# EAGLE design TempGuard-v2-revB (EAGLE 9.6.1)
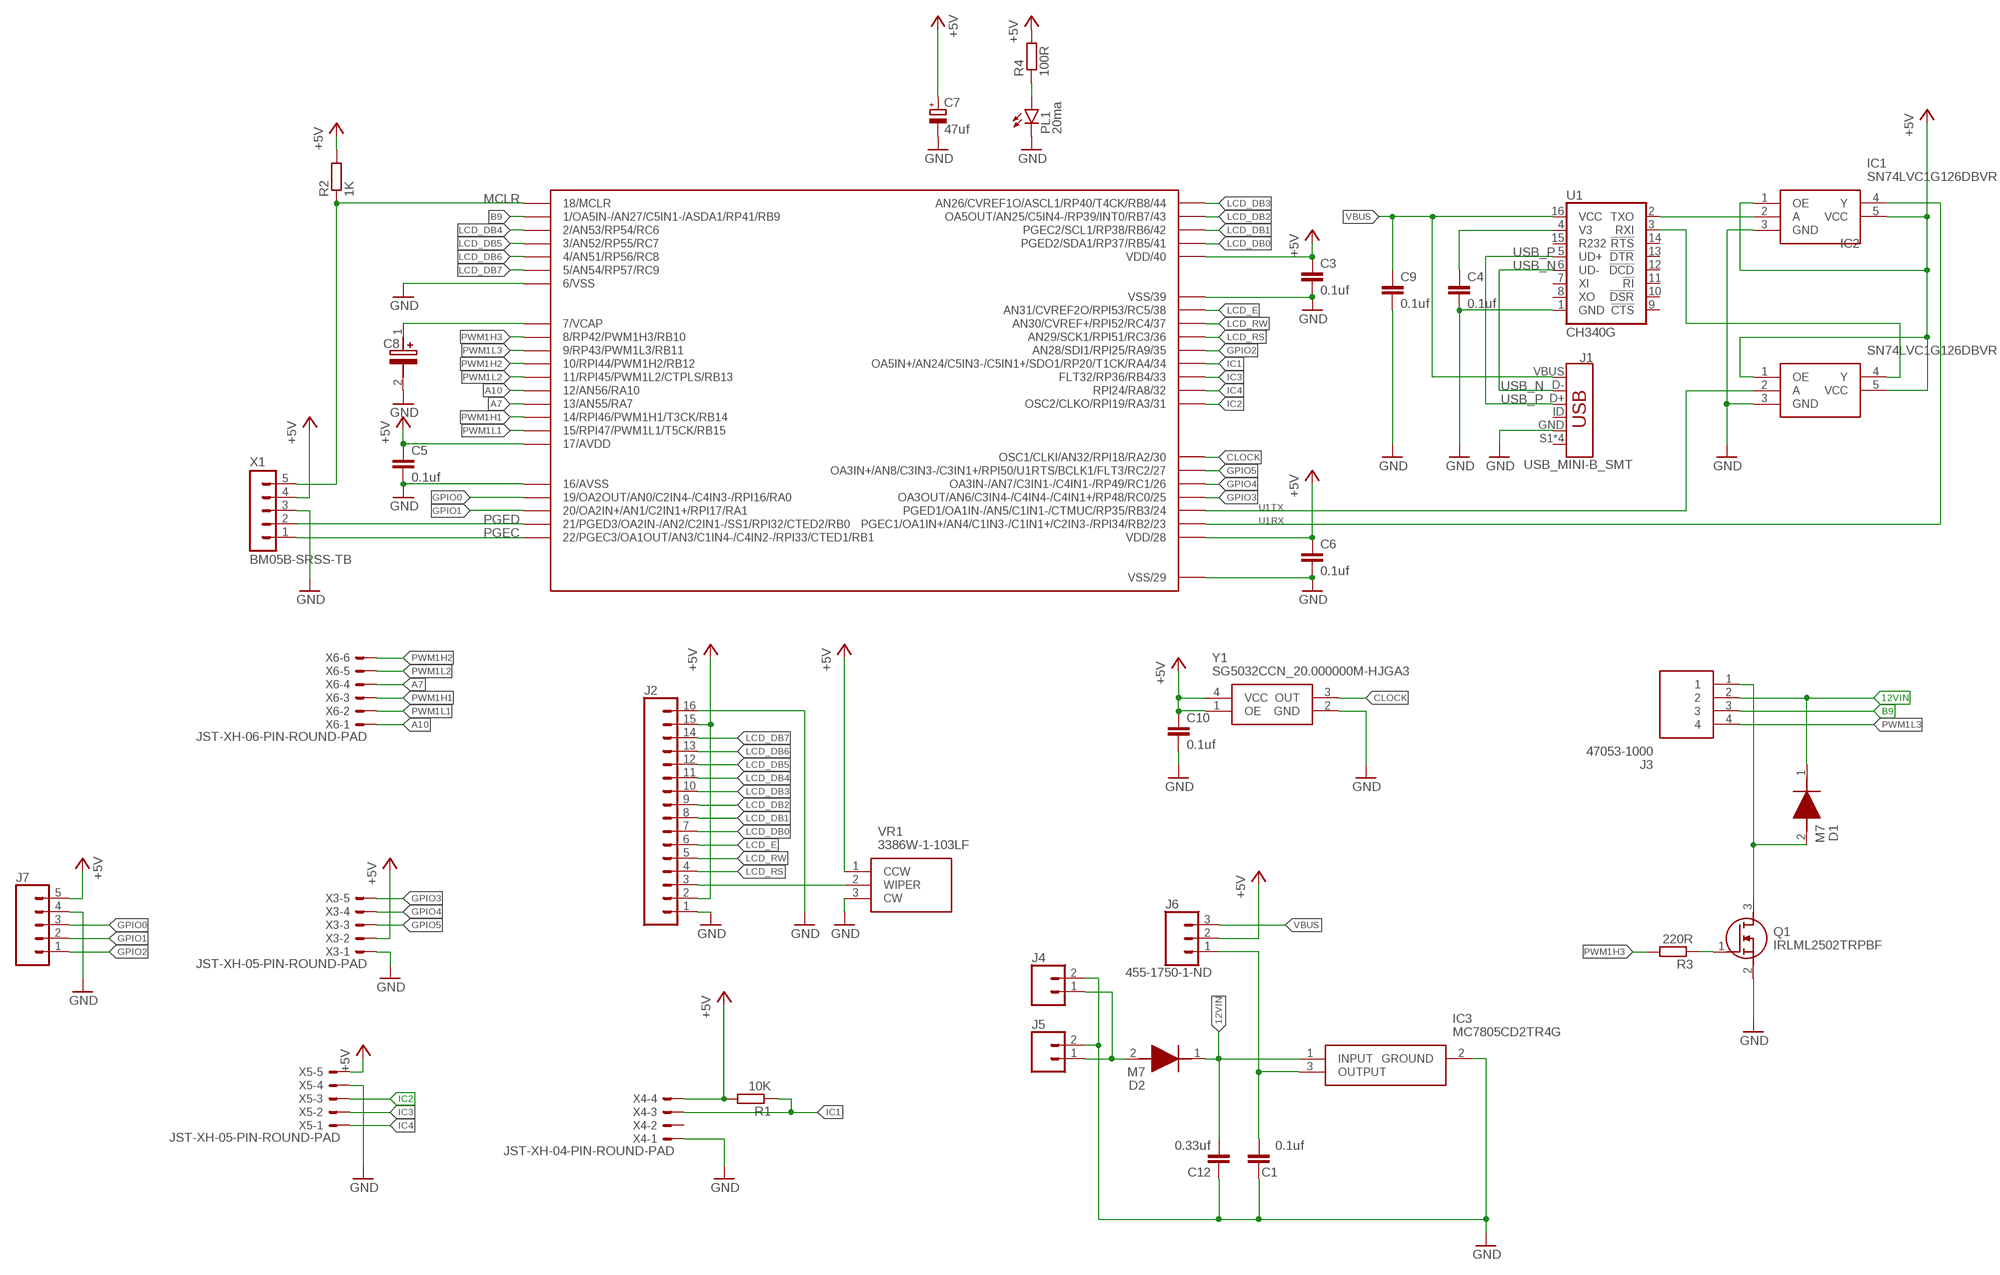
[diagram p0: schematic, sheet 1]

## Parts
C1  0.1uf  C-EUC0805  [C0805]
C3  0.1uf  C-EUC0805  [C0805]
C4  0.1uf  C-EUC0805  [C0805]
C5  0.1uf  C-EUC0805  [C0805]
C6  0.1uf  C-EUC0805  [C0805]
C7  47uf  CPOL-EUE2-5  [E2-5]
C8  T491C106K016ATAUTO  [T491C]
C9  0.1uf  C-EUC0805  [C0805]
C10  0.1uf  C-EUC0805  [C0805]
C12  0.33uf  C-EUC1206  [C1206]
D1  M7  [DIOM5327X240N]
D2  M7  [DIOM5327X240N]
IC1  SN74LVC1G126DBVR  [SOT95P280X145-5N]
IC2  SN74LVC1G126DBVR  [SOT95P280X145-5N]
IC3  MC7805CD2TR4G  [MC7805CD2TR4G]
J1  USB_MINI-B_SMT  [USB-MINIB]
J2  CONN_16LONGPADS  [1X16_LONGPADS]
J3  47053-1000  [470531000]
J4  CONN_025MM  [SCREWTERMINAL-5MM-2]
J5  CONN_025MM  [SCREWTERMINAL-5MM-2]
J6  455-1750-1-ND  CONN_03  [1X03]
J7  CONN_05  [1X05]
MCU1  DSPIC33EV64GM004-I/PT  [QFP80P1200X1200X120-44]
PL1  20ma  LEDSML0805  [SML0805]
Q1  IRLML2502TRPBF  [SOT95P237X112-3N]
R1  10K  R-EU_R0805  [R0805]
R2  1K  R-EU_R0805  [R0805]
R3  220R  R-EU_R0805  [R0805]
R4  100R  R-EU_R0805  [R0805]
U1  CH340G  CH340GSMD  [SO016]
VR1  3386W-1-103LF  [3386W]
X1  BM05B-SRSS-TB  [BM05B-SRSS-TB]
X3  JST-XH-05-PIN-ROUND-PAD  [JST-XH-05-PACKAGE-ROUND-PAD]
X4  JST-XH-04-PIN-ROUND-PAD  [JST-XH-04-PACKAGE-ROUND-PAD]
X5  JST-XH-05-PIN-ROUND-PAD  [JST-XH-05-PACKAGE-ROUND-PAD]
X6  JST-XH-06-PIN-ROUND-PAD  [JST-XH-06-PACKAGE-ROUND-PAD]
Y1  SG5032CCN_20.000000M-HJGA3  [SG5032CCN20000000MHJGA3]

## Nets
12VIN [logic]: C12.2 D1.1(K) D2.1(K) IC3.1(INPUT) J3.2
+5V [power]: C3.1 C5.1 C6.1 C7.+ C10.1 IC1.1(OE) IC1.5(VCC) IC2.1(OE) IC2.5(VCC) J2.2 J2.15 J6.2 J7.5 MCU1.17(17/AVDD) MCU1.28(VDD/28) MCU1.40(VDD/40) R1.2 R2.2 R4.2 VR1.1(CCW) X1.4 X3.2 X4.4 X5.5 Y1.1(OE) Y1.4(VCC)
A7 [logic]: MCU1.13(13/AN55/RA7) X6.4
A10 [logic]: MCU1.12(12/AN56/RA10) X6.1
B9 [logic]: J3.3 MCU1.1(1/OA5IN-/AN27/C5IN1-/ASDA1/RP41/RB9)
CLOCK [logic]: MCU1.30(OSC1/CLKI/AN32/RPI18/RA2/30) Y1.3(OUT)
GND [power]: C1.1 C3.2 C4.2 C5.2 C6.2 C7.- C8.2(-) C9.2 C10.2 C12.1 IC1.3(GND) IC2.3(GND) IC3.2(GROUND) J1.GND J2.1 J2.16 J4.2 J5.2 J7.4 MCU1.6(6/VSS) MCU1.16(16/AVSS) MCU1.29(VSS/29) MCU1.39(VSS/39) PL1.C Q1.2(S) U1.1(GND) VR1.3(CW) X1.3 X3.1 X4.1 X5.4 Y1.2(GND)
GPIO0 [logic]: J7.3 MCU1.19(19/OA2OUT/AN0/C2IN4-/C4IN3-/RPI16/RA0)
GPIO1 [logic]: J7.2 MCU1.20(20/OA2IN+/AN1/C2IN1+/RPI17/RA1)
GPIO2 [logic]: J7.1 MCU1.35(AN28/SDI1/RPI25/RA9/35)
GPIO3 [logic]: MCU1.25(OA3OUT/AN6/C3IN4-/C4IN4-/C4IN1+/RP48/RC0/25) X3.5
GPIO4 [logic]: MCU1.26(OA3IN-/AN7/C3IN1-/C4IN1-/RP49/RC1/26) X3.4
GPIO5 [logic]: MCU1.27(OA3IN+/AN8/C3IN3-/C3IN1+/RPI50/U1RTS/BCLK1/FLT3/RC2/27) X3.3
IC1 [logic]: MCU1.34(OA5IN+/AN24/C5IN3-/C5IN1+/SDO1/RP20/T1CK/RA4/34) R1.1 X4.3
IC2 [logic]: MCU1.31(OSC2/CLKO/RPI19/RA3/31) X5.3
IC3 [logic]: MCU1.33(FLT32/RP36/RB4/33) X5.2
IC4 [logic]: MCU1.32(RPI24/RA8/32) X5.1
LCD_DB0 [logic]: J2.7 MCU1.41(PGED2/SDA1/RP37/RB5/41)
LCD_DB1 [logic]: J2.8 MCU1.42(PGEC2/SCL1/RP38/RB6/42)
LCD_DB2 [logic]: J2.9 MCU1.43(OA5OUT/AN25/C5IN4-/RP39/INT0/RB7/43)
LCD_DB3 [logic]: J2.10 MCU1.44(AN26/CVREF1O/ASCL1/RP40/T4CK/RB8/44)
LCD_DB4 [logic]: J2.11 MCU1.2(2/AN53/RP54/RC6)
LCD_DB5 [logic]: J2.12 MCU1.3(3/AN52/RP55/RC7)
LCD_DB6 [logic]: J2.13 MCU1.4(4/AN51/RP56/RC8)
LCD_DB7 [logic]: J2.14 MCU1.5(5/AN54/RP57/RC9)
LCD_E [logic]: J2.6 MCU1.38(AN31/CVREF2O/RPI53/RC5/38)
LCD_RS [logic]: J2.4 MCU1.36(AN29/SCK1/RPI51/RC3/36)
LCD_RW [logic]: J2.5 MCU1.37(AN30/CVREF+/RPI52/RC4/37)
MCLR [logic]: MCU1.18(18/MCLR) R2.1 X1.5
N$1 [logic]: C4.1 U1.4(V3)
N$3 [power]: D1.2(A) J3.1 Q1.3(D)
N$4 [logic]: IC1.2(A) U1.2(TXO)
N$5 [logic]: J2.3 VR1.2(WIPER)
N$6 [logic]: PL1.A R4.1
N$7: Q1.1(G) R3.1
N$8 [logic]: D2.2(A) J4.1 J5.1
N$9 [power]: C1.2 IC3.3(OUTPUT) J6.1
N$14 [logic]: IC2.4(Y) U1.3(RXI)
PGEC [logic]: MCU1.22(22/PGEC3/OA1OUT/AN3/C1IN4-/C4IN2-/RPI33/CTED1/RB1) X1.1
PGED [logic]: MCU1.21(21/PGED3/OA2IN-/AN2/C2IN1-/SS1/RPI32/CTED2/RB0) X1.2
PWM1H1 [logic]: MCU1.14(14/RPI46/PWM1H1/T3CK/RB14) X6.3
PWM1H2 [logic]: MCU1.10(10/RPI44/PWM1H2/RB12) X6.6
PWM1H3 [logic]: MCU1.8(8/RP42/PWM1H3/RB10) R3.2
PWM1L1 [logic]: MCU1.15(15/RPI47/PWM1L1/T5CK/RB15) X6.2
PWM1L2 [logic]: MCU1.11(11/RPI45/PWM1L2/CTPLS/RB13) X6.5
PWM1L3 [logic]: J3.4 MCU1.9(9/RP43/PWM1L3/RB11)
U1RX [logic]: IC1.4(Y) MCU1.23(PGEC1/OA1IN+/AN4/C1IN3-/C1IN1+/C2IN3-/RPI34/RB2/23)
U1TX [logic]: IC2.2(A) MCU1.24(PGED1/OA1IN-/AN5/C1IN1-/CTMUC/RP35/RB3/24)
USB_N [logic]: J1.D- U1.6(UD-)
USB_P [logic]: J1.D+ U1.5(UD+)
VBUS [logic]: C9.1 J1.VBUS J6.3 U1.16(VCC)
VCAP [logic]: C8.1(+) MCU1.7(7/VCAP)
Unconnected: J1.ID J1.S1(SHIELD) J1.S2(SHIELD) J1.S3(SHIELD) J1.S4(SHIELD) U1.7(XI) U1.8(XO) U1.9(!CTS) U1.10(!DSR) U1.11(!RI) U1.12(!DCD) U1.13(!DTR) U1.14(!RTS) U1.15(R232) X4.2

## Library data of the parts
C1 C3-C6 C9 C10 C12 = rcl:C-EU: CAPACITOR, European symbol; SPICEPREFIX: C
C7 = rcl:CPOL-EU: POLARIZED CAPACITOR, European symbol; SPICEPREFIX: C
C8 = T491C106K016ATAUTO:T491C106K016ATAUTO: T491 Auto, Tantalum, MnO2 Tantalum, Commercial Grade, 10 uF, 10%, 16 VDC, 125C, -55C, 85C, SMD, MnO2, Molded, Auto, AEC-Q200, 6 % , 1.8 Ohms, 1600 nA, 224.48 mg, 6032, 2.5mm, Height Max = 2.8mm, 500 Source: Datasheet <https://content.kemet.com/datasheets/KEM_T2050_T491_AUTO.pdf>; DESCRIPTION: T491 Auto, Tantalum, MnO2 Tantalum, Commercial Grade, 10 uF, 10%, 16 VDC, 125C, -55C, 85C, SMD, MnO2, Molded, Auto, AEC-Q200, 6 % , 1.8 Ohms, 1600 nA, 224.48 mg, 6032, 2.5mm, Height Max = 2.8mm, 500; HEIGHT: 2.8mm; MANUFACTURER_NAME: KEMET; MANUFACTURER_PART_NUMBER: T491C106K016ATAUTO; MOUSER_PART_NUMBER: 80-T491C106K16ATAUTO; MOUSER_PRICE-STOCK: https://www.mouser.co.uk/ProductDetail/KEMET/T491C106K016ATAUTO?qs=xy9o06WtvdCgLOa6Blm85A%3D%3D; VALUEX: 10uF
D1 D2 = M7:M7: Standard recovery rectifier diode Source: Datasheet <https://www.mouser.in/datasheet/2/849/m1-2577421.pdf>; DESCRIPTION: Standard recovery rectifier diode; HEIGHT: 2.4mm; MANUFACTURER_NAME: Diotec; MANUFACTURER_PART_NUMBER: M7; MOUSER_PART_NUMBER: 637-M7; MOUSER_PRICE-STOCK: https://www.mouser.co.uk/ProductDetail/Diotec-Semiconductor/M7?qs=OlC7AqGiEDln9itgkDD%2F2A%3D%3D
IC1 IC2 = SN74LVC1G126DBVR:SN74LVC1G126DBVR: Texas Instruments SN74LVC1G126DBVR, Buffer 3-State, Non-Inverting, 1.65 5.5 V, 5-Pin SOT-23 Source: Datasheet <http://www.ti.com/lit/ds/symlink/sn74lvc1g126.pdf>; DESCRIPTION: Texas Instruments SN74LVC1G126DBVR, Buffer 3-State, Non-Inverting, 1.65 5.5 V, 5-Pin SOT-23; HEIGHT: 1.45mm; MANUFACTURER_NAME: Texas Instruments; MANUFACTURER_PART_NUMBER: SN74LVC1G126DBVR; MOUSER_PART_NUMBER: 595-SN74LVC1G126DBVR; MOUSER_PRICE-STOCK: https://www.mouser.co.uk/ProductDetail/Texas-Instruments/SN74LVC1G126DBVR?qs=pajgIaoyDUi3T2WgNNfd3w%3D%3D
IC3 = MC7805CD2TR4G:MC7805CD2TR4G: Linear Voltage Regulators 5V 1A Positive Source: Datasheet <https://datasheet.lcsc.com/szlcsc/ON-Semicon-ON-MC7805CD2TR4G_C38743.pdf>; DESCRIPTION: Linear Voltage Regulators 5V 1A Positive; HEIGHT: 4.572mm; MANUFACTURER_NAME: onsemi; MANUFACTURER_PART_NUMBER: MC7805CD2TR4G; MOUSER_PART_NUMBER: 863-MC7805CD2TR4G; MOUSER_PRICE-STOCK: https://www.mouser.co.uk/ProductDetail/onsemi/MC7805CD2TR4G?qs=%252B9%2Fcbd0IE0TA2t8QN7DaSw%3D%3D
J1 = SparkFun-Connectors:USB_MINI-B: USB type Mini-B Connector Breaks out 5th pin, and includes shield pins if needed. SparkFun Products: SparkFun FTDI Basic Breakout <https://www.sparkfun.com/products/9716> SparkFun XBee Explorer USB <https://www.sparkfun.com/products/11812> SparkFun Redboard <https://www.sparkfun.com/products/12757>; PROD_ID: CONN-08193; SF_ID: PRT-00587
J2 = SparkFun-Connectors:CONN_16: Multi connection point. Often used as Generic Header-pin footprint for 0.1 inch spaced/style header connections On any of the 0.1 inch spaced packages, you can populate with these: Break Away Headers - Straight <https://www.sparkfun.com/products/116> (PRT-00116) Break Away Male Headers - Right Angle <https://www.sparkfun.com/products/553> (PRT-00553) Female Headers <https://www.sparkfun.com/products/115> (PRT-00115) Break Away Headers - Machine Pin <https://www.sparkfun.com/products/117> (PRT-00117) Break Away Female Headers - Swiss Machine Pin <https://www.sparkfun.com/products/743> (PRT-00743) For SCREWTERMINALS and SPRING TERMINALS visit here: Screw Terimnals on SparkFun.com <https://www.sparkfun.com/search/results?term=Screw+Terminals> (5mm/3.5mm/2.54mm spacing) This device is also useful as a general connection point to wire up your design to another part of your project. Our various solder wires solder well into these plated through hole pads. Hook-Up Wire - Assortment (Stranded, 22 AWG) <https://www.sparkfun.com/products/11375> (PRT-11375) Hook-Up Wire - Assortment (Solid Core, 22 AWG) <https://www.sparkfun.com/products/11367> (PRT-11367) View the entire wire category on our website here <https://www.sparkfun.com/categories/141> Special notes: Molex polarized connector foot print use with SKU : PRT-08231 with associated crimp pins and housings. 1MM SMD Version SKU: PRT-10208 NOTES ON THE VARIANTS LOCK and LOCK_LONGPADS... This footprint was designed to help hold the alignment of a through-hole component (i.e. 6-pin header) while soldering it into place. You may notice that each hole has been shifted either up or down by 0.005 of an inch from it's more standard position (which is a perfectly straight line). This slight alteration caused the pins (the squares in the middle) to touch the edges of the holes. Because they are alternating, it causes a "brace" to hold the component in place. 0.005 has proven to be the perfect amount of "off-center" position when using our standard breakaway headers. Although looks a little odd when you look at the bare footprint, once you have a header in there, the alteration is very hard to notice. Also,if you push a header all the way into place, it is covered up entirely on the bottom side.
J3 = 47053-1000:47053-1000: MOLEX - 47053-1000 - HEADER, 4POS, 1ROW, 2.54MM Source: Datasheet <http://www.molex.com/pdm_docs/sd/470531000_sd.pdf>; DESCRIPTION: MOLEX - 47053-1000 - HEADER, 4POS, 1ROW, 2.54MM; HEIGHT: 8mm; MANUFACTURER_NAME: Molex; MANUFACTURER_PART_NUMBER: 47053-1000; MOUSER_PART_NUMBER: 538-47053-1000; MOUSER_PRICE-STOCK: https://www.mouser.co.uk/ProductDetail/Molex/47053-1000?qs=ph4zPCVRuvqoDX7hrEhxNA%3D%3D
J4 J5 = SparkFun-Connectors:CONN_02: Multi connection point. Often used as Generic Header-pin footprint for 0.1 inch spaced/style header connections On any of the 0.1 inch spaced packages, you can populate with these: Break Away Headers - Straight <https://www.sparkfun.com/products/116> (PRT-00116) Break Away Male Headers - Right Angle <https://www.sparkfun.com/products/553> (PRT-00553) Female Headers <https://www.sparkfun.com/products/115> (PRT-00115) Break Away Headers - Machine Pin <https://www.sparkfun.com/products/117> (PRT-00117) Break Away Female Headers - Swiss Machine Pin <https://www.sparkfun.com/products/743> (PRT-00743) For SCREWTERMINALS and SPRING TERMINALS visit here: Screw Terimnals on SparkFun.com <https://www.sparkfun.com/search/results?term=Screw+Terminals> (5mm/3.5mm/2.54mm spacing) This device is also useful as a general connection point to wire up your design to another part of your project. Our various solder wires solder well into these plated through hole pads. Hook-Up Wire - Assortment (Stranded, 22 AWG) <https://www.sparkfun.com/products/11375> (PRT-11375) Hook-Up Wire - Assortment (Solid Core, 22 AWG) <https://www.sparkfun.com/products/11367> (PRT-11367) View the entire wire category on our website here <https://www.sparkfun.com/categories/141> Special notes: Molex polarized connector foot print use with: PRT-08233 with associated crimp pins and housings. 2.54_SCREWTERM for use with PRT-10571. 3.5mm Screw Terminal footprints for PRT-08084 5mm Screw Terminal footprints for use with PRT-08432; SF_SKU: PRT-08432
J6 = SparkFun-Connectors:CONN_03: Multi connection point. Often used as Generic Header-pin footprint for 0.1 inch spaced/style header connections On any of the 0.1 inch spaced packages, you can populate with these: Break Away Headers - Straight <https://www.sparkfun.com/products/116> (PRT-00116) Break Away Male Headers - Right Angle <https://www.sparkfun.com/products/553> (PRT-00553) Female Headers <https://www.sparkfun.com/products/115> (PRT-00115) Break Away Headers - Machine Pin <https://www.sparkfun.com/products/117> (PRT-00117) Break Away Female Headers - Swiss Machine Pin <https://www.sparkfun.com/products/743> (PRT-00743) Stackable Header - 3 Pin (Female, 0.1") <https://www.sparkfun.com/products/13875> (PRT-13875) For SCREWTERMINALS and SPRING TERMINALS visit here: Screw Terimnals on SparkFun.com <https://www.sparkfun.com/search/results?term=Screw+Terminals> (5mm/3.5mm/2.54mm spacing) This device is also useful as a general connection point to wire up your design to another part of your project. Our various solder wires solder well into these plated through hole pads. Hook-Up Wire - Assortment (Stranded, 22 AWG) <https://www.sparkfun.com/products/11375> (PRT-11375) Hook-Up Wire - Assortment (Solid Core, 22 AWG) <https://www.sparkfun.com/products/11367> (PRT-11367) View the entire wire category on our website here <https://www.sparkfun.com/categories/141> Special notes: Molex polarized connector foot print use with SKU : PRT-08232 with associated crimp pins and housings.; PROD_ID: XXX-00000
J7 = SparkFun-Connectors:CONN_05: Multi connection point. Often used as Generic Header-pin footprint for 0.1 inch spaced/style header connections On any of the 0.1 inch spaced packages, you can populate with these: Break Away Headers - Straight <https://www.sparkfun.com/products/116> (PRT-00116) Break Away Male Headers - Right Angle <https://www.sparkfun.com/products/553> (PRT-00553) Female Headers <https://www.sparkfun.com/products/115> (PRT-00115) Break Away Headers - Machine Pin <https://www.sparkfun.com/products/117> (PRT-00117) Break Away Female Headers - Swiss Machine Pin <https://www.sparkfun.com/products/743> (PRT-00743) For SCREWTERMINALS and SPRING TERMINALS visit here: Screw Terimnals on SparkFun.com <https://www.sparkfun.com/search/results?term=Screw+Terminals> (5mm/3.5mm/2.54mm spacing) This device is also useful as a general connection point to wire up your design to another part of your project. Our various solder wires solder well into these plated through hole pads. Hook-Up Wire - Assortment (Stranded, 22 AWG) <https://www.sparkfun.com/products/11375> (PRT-11375) Hook-Up Wire - Assortment (Solid Core, 22 AWG) <https://www.sparkfun.com/products/11367> (PRT-11367) View the entire wire category on our website here <https://www.sparkfun.com/categories/141> Special notes: Molex polarized connector foot print use with SKU : PRT-08231 with associated crimp pins and housings. 1MM SMD Version SKU: PRT-10208
MCU1 = Angelo-Microcontrollers:DSPIC33EV64GM004-I/PT: dsPIC33EV64GM004-I/PT
PL1 = led:LED: LED OSRAM: - CHIPLED LG R971, LG N971, LY N971, LG Q971, LY Q971, LO R971, LY R971 LH N974, LH R974 LS Q976, LO Q976, LY Q976 LO Q996 - Hyper CHIPLED LW Q18S LB Q993, LB Q99A, LB R99A - SideLED LS A670, LO A670, LY A670, LG A670, LP A670 LB A673, LV A673, LT A673, LW A673 LH A674 LY A675 LS A676, LA A676, LO A676, LY A676, LW A676 LS A679, LY A679, LG A679 - Hyper Micro SIDELED® LS Y876, LA Y876, LO Y876, LY Y876 LT Y87S - SmartLED LW L88C, LW L88S LB L89C, LB L89S, LG L890 LS L89K, LO L89K, LY L89K LS L896, LA L896, LO L896, LY L896 - TOPLED LS T670, LO T670, LY T670, LG T670, LP T670 LSG T670, LSP T670, LSY T670, LOP T670, LYG T670 LG T671, LOG T671, LSG T671 LB T673, LV T673, LT T673, LW T673 LH T674 LS T676, LA T676, LO T676, LY T676, LB T676, LH T676, LSB T676, LW T676 LB T67C, LV T67C, LT T67C, LS T67K, LO T67K, LY T67K, LW E67C LS E67B, LA E67B, LO E67B, LY E67B, LB E67C, LV E67C, LT E67C LW T67C LS T679, LY T679, LG T679 LS T770, LO T770, LY T770, LG T770, LP T770 LB T773, LV T773, LT T773, LW T773 LH T774 LS E675, LA E675, LY E675, LS T675 LS T776, LA T776, LO T776, LY T776, LB T776 LHGB T686 LT T68C, LB T68C - Hyper Mini TOPLED® LB M676 - Mini TOPLED Santana® LG M470 LS M47K, LO M47K, LY M47K Source: http://www.osram.convergy.de LUXEON: - LUMILED® LXK2-PW12-R00, LXK2-PW12-S00, LXK2-PW14-U00, LXK2-PW14-V00 LXK2-PM12-R00, LXK2-PM12-S00, LXK2-PM14-U00 LXK2-PE12-Q00, LXK2-PE12-R00, LXK2-PE12-S00, LXK2-PE14-T00, LXK2-PE14-U00 LXK2-PB12-K00, LXK2-PB12-L00, LXK2-PB12-M00, LXK2-PB14-N00, LXK2-PB14-P00, LXK2-PB14-Q00 LXK2-PR12-L00, LXK2-PR12-M00, LXK2-PR14-Q00, LXK2-PR14-R00 LXK2-PD12-Q00, LXK2-PD12-R00, LXK2-PD12-S00 LXK2-PH12-R00, LXK2-PH12-S00 LXK2-PL12-P00, LXK2-PL12-Q00, LXK2-PL12-R00 Source: www.luxeon.com KINGBRIGHT: KA-3528ASYC Source: www.kingbright.com
Q1 = IRLML2502TRPBF:IRLML2502TRPBF: IRLML2502TRPBF N-Channel MOSFET, 4.2 A, 20 V IRLML2502, 3-Pin SOT-23 Infineon Source: Datasheet; DESCRIPTION: IRLML2502TRPBF N-Channel MOSFET, 4.2 A, 20 V IRLML2502, 3-Pin SOT-23 Infineon; HEIGHT: 1.12mm; MANUFACTURER_NAME: Infineon; MANUFACTURER_PART_NUMBER: IRLML2502TRPBF; MOUSER_PART_NUMBER: 942-IRLML2502TRPBF; MOUSER_PRICE-STOCK: https://www.mouser.co.uk/ProductDetail/Infineon-Technologies/IRLML2502TRPBF?qs=9%252BKlkBgLFf37zQw9UlZd%2FQ%3D%3D
R1-R4 = rcl:R-EU_: RESISTOR, European symbol; SPICEPREFIX: R
U1 = SparkFun-IC-Comms:CH340G: A simple USB 2.0 to Serial IC.; PROD_ID: IC-13498
VR1 = 3386W-1-103LF:3386W-1-103LF: Trimmer Resistors - Through Hole 3/8" 10Kohms 10% 0.5Watts Square Source: Datasheet <https://www.bourns.com/pdfs/3386.pdf>; DESCRIPTION: Trimmer Resistors - Through Hole 3/8" 10Kohms 10% 0.5Watts Square; HEIGHT: mm; MANUFACTURER_NAME: Bourns; MANUFACTURER_PART_NUMBER: 3386W-1-103LF; MOUSER_PART_NUMBER: 652-3386W-1-103LF; MOUSER_PRICE-STOCK: https://www.mouser.co.uk/ProductDetail/Bourns/3386W-1-103LF?qs=0VqvB9JLnItKvPGevjBaLA%3D%3D
X1 = con-JST SH:BM05B-SRSS: JST SH series header 1.00mm pitch disconnectable crimp style connectors, vertical (side entry type), 5 pins
X3 X5 = Rembrandt Electronics - JST XH Connectors v1-0:JST-XH-05-PIN: JST XH Connector 2 Pin Wire to board connector. Pitch: 2,54 mm, (0.100") Number of pins: 5 Created by Rembrandt Electronics www.rembrandtelectronics.com
X4 = Rembrandt Electronics - JST XH Connectors v1-0:JST-XH-04-PIN: JST XH Connector 2 Pin Wire to board connector. Pitch: 2,54 mm, (0.100") Number of pins: 4 Created by Rembrandt Electronics www.rembrandtelectronics.com
X6 = Rembrandt Electronics - JST XH Connectors v1-0:JST-XH-06-PIN: JST XH Connector 2 Pin Wire to board connector. Pitch: 2,54 mm, (0.100") Number of pins: 6 Created by Rembrandt Electronics www.rembrandtelectronics.com
Y1 = angeo-SG5032CCN_20.000000M-HJGA3:SG5032CCN_20.000000M-HJGA3: Standard Clock Oscillators 20MHz 50ppm -40C +85C Source: Datasheet <https://componentsearchengine.com/Datasheets/1/SG5032CCN 20.000000M-HJGA3.pdf>; DESCRIPTION: Standard Clock Oscillators 20MHz 50ppm -40C +85C; HEIGHT: 1.3mm; MANUFACTURER_NAME: Epson Timing; MANUFACTURER_PART_NUMBER: SG5032CCN 20.000000M-HJGA3; MOUSER_PART_NUMBER: 732-5032CCN20.0HJGA3; MOUSER_PRICE-STOCK: https://www.mouser.co.uk/ProductDetail/Epson-Timing/SG5032CCN-20.000000M-HJGA3?qs=6J2kD0vu%2F2U2U6P0qrgWFg%3D%3D

## Net classes
0 default: width 0.203 mm, drill 0.254 mm, clearance 0.203 mm
1 logic: width 0.203 mm, drill 0.254 mm, clearance 0.203 mm
2 power: width 0.406 mm, drill 0.254 mm, clearance 0.203 mm

## Board
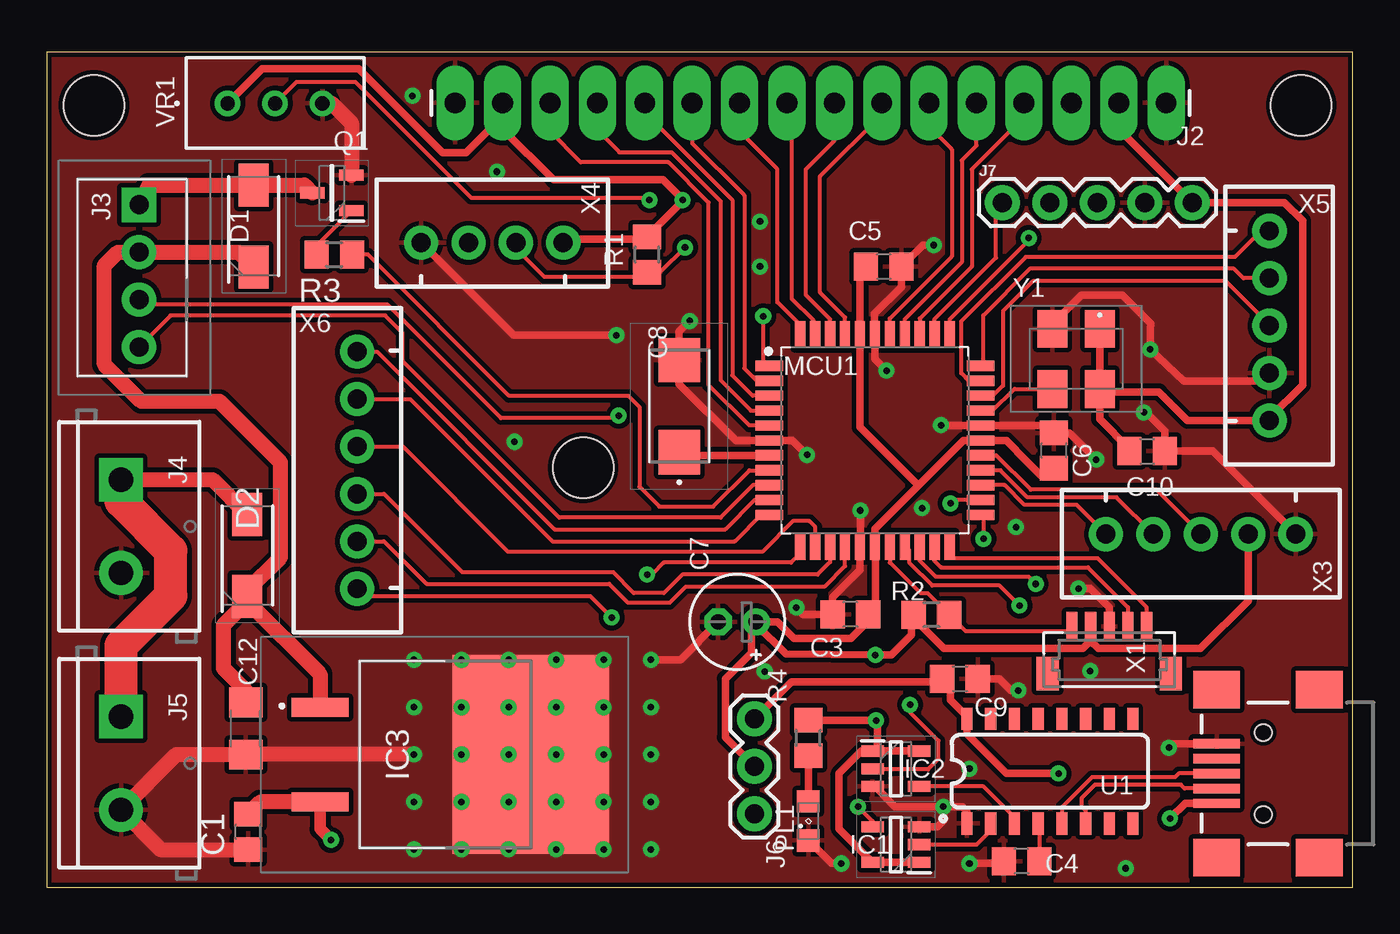
[diagram p1: board, top side]
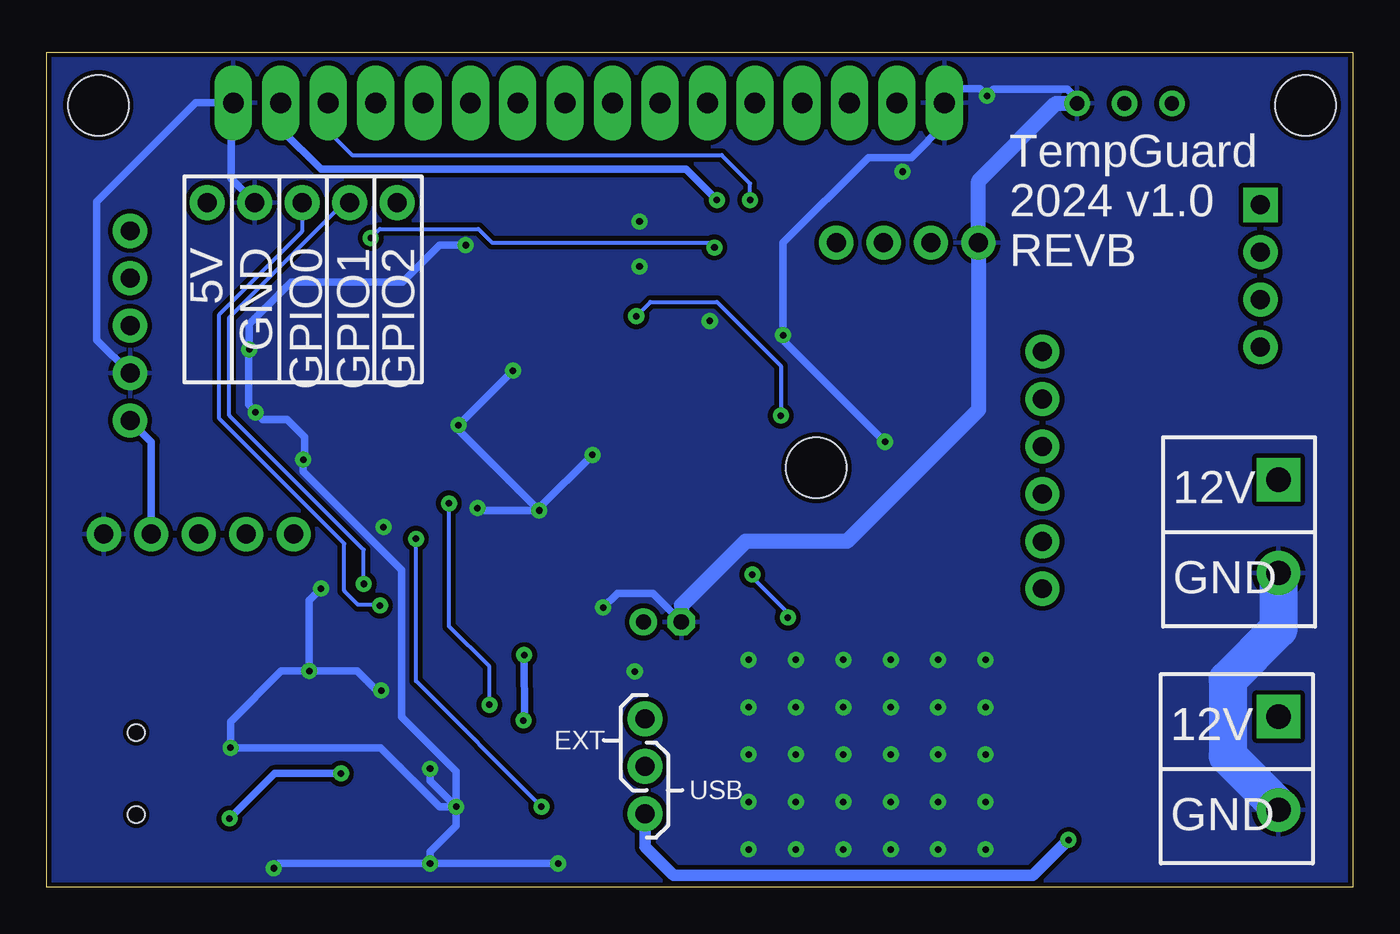
[diagram p2: board, bottom side, seen from below]

Size 70 x 44.75 mm. Coordinates in mm from the lower left corner, seen from the top.
Outline: 0,0 70,0 70,44.76 0,44.76 0,0
Copper layers (1*16): Top 0.035mm / dielectric 1.6mm / Bottom 0.035mm
Design rules "jlcpcb-2layers *": minimum track width 5mil, minimum drill 0.3mm, track to track 6mil, track to pad 6mil, pad to pad 6mil, via to via 6mil, smd to smd 6mil, copper to edge 0.2mm, drill to drill 8mil, minimum pad ring 10mil, minimum via ring 10mil, stop-mask expansion 4mil, vias tented up to drill 0mil, thermal gap 10mil
Holes 3.25 mm at 67.23,41.91 28.75,22.48 2.54,41.91

### Footprints (pad centres in the part's own frame; a part is rotated, then mirrored left to right if it is on the bottom)
C0805 = smd 1.3 x 1.5: 1 -0.95,0; 2 0.95,0
E2-5 = drill 0.813 pad 1.27: + -1.016,0 | drill 0.813 pad 1.27 octagon: - 1.016,0
T491C = smd 2.37 x 2.23: 1 -2.47,0; 2 2.47,0
C1206 = smd 1.6 x 1.8: 1 -1.4,0; 2 1.4,0
DIOM5327X240N = smd 2.3 x 1.6: 1 -2.2,0; 2 2.2,0
SOT95P280X145-5N = smd 1.2 x 0.6: 1 -1.25,0.95; 2 -1.25,0; 3 -1.25,-0.95; 4 1.25,-0.95; 5 1.25,0.95
MC7805CD2TR4G = smd 1.016 x 3.05: 1 -2.54,0; 3 2.54,0 | smd 10.66 x 8.38: 2 0,11.305
USB-MINIB = smd 2.5 x 0.5: D+ 2.5,0; D- 2.5,0.8; GND 2.5,-1.6; ID 2.5,-0.8; VBUS 2.5,1.6 | smd 2.5 x 2: S1 -3,4.5; S2 2.5,4.5; S3 -3,-4.5; S4 2.5,-4.5 | hole 0.9: 0,2.2; 0,-2.2
1X16_LONGPADS = drill 1.118 pad 1.88 long: 1 0,0; 2 2.54,0; 3 5.08,0; 4 7.62,0; 5 10.16,0; 6 12.7,0; 7 15.24,0; 8 17.78,0; 9 20.32,0; 10 22.86,0; 11 25.4,0; 12 27.94,0; 13 30.48,0; 14 33.02,0; 15 35.56,0; 16 38.1,0
470531000 = drill 1.02 pad 1.53 square: 1 0,0 | drill 1.02 pad 1.55: 2 -2.54,0; 3 -5.08,0; 4 -7.62,0
SCREWTERMINAL-5MM-2 = drill 1.3 pad 2.032 square: 1 0,0 | drill 1.3 pad 2.032: 2 5,0
1X03 = drill 1.016 pad 1.88: 1 0,0; 2 2.54,0; 3 5.08,0
1X05 = drill 1.016 pad 1.88: 1 0,0; 2 2.54,0; 3 5.08,0; 4 7.62,0; 5 10.16,0
QFP80P1200X1200X120-44 = smd 1.469 x 0.547: 1 -5.671,4; 2 -5.671,3.2; 3 -5.671,2.4; 4 -5.671,1.6; 5 -5.671,0.8; 6 -5.671,0; 7 -5.671,-0.8; 8 -5.671,-1.6; 9 -5.671,-2.4; 10 -5.671,-3.2; 11 -5.671,-4; 23 5.671,-4; 24 5.671,-3.2; 25 5.671,-2.4; 26 5.671,-1.6; 27 5.671,-0.8; 28 5.671,0; 29 5.671,0.8; 30 5.671,1.6; 31 5.671,2.4; 32 5.671,3.2; 33 5.671,4 | smd 0.547 x 1.469: 12 -4,-5.671; 13 -3.2,-5.671; 14 -2.4,-5.671; 15 -1.6,-5.671; 16 -0.8,-5.671; 17 0,-5.671; 18 0.8,-5.671; 19 1.6,-5.671; 20 2.4,-5.671; 21 3.2,-5.671; 22 4,-5.671; 34 4,5.671; 35 3.2,5.671; 36 2.4,5.671; 37 1.6,5.671; 38 0.8,5.671; 39 0,5.671; 40 -0.8,5.671; 41 -1.6,5.671; 42 -2.4,5.671; 43 -3.2,5.671; 44 -4,5.671
SML0805 = smd 1.2 x 1.2: A 1.05,0; C -1.05,0
SOT95P237X112-3N = smd 1.3 x 0.6: 1 -1.05,0.95; 2 -1.05,-0.95; 3 1.05,0
R0805 = smd 1.3 x 1.5: 1 -0.95,0; 2 0.95,0
SO016 = smd 0.6 x 1.2: 1 -4.445,-2.8; 2 -3.175,-2.8; 3 -1.905,-2.8; 4 -0.635,-2.8; 5 0.635,-2.8; 6 1.905,-2.8; 7 3.175,-2.8; 8 4.445,-2.8; 9 4.445,2.8; 10 3.175,2.8; 11 1.905,2.8; 12 0.635,2.8; 13 -0.635,2.8; 14 -1.905,2.8; 15 -3.175,2.8; 16 -4.445,2.8
3386W = drill 0.76 pad 1.26: 1 -2.54,-2.44; 2 0,-2.44; 3 2.54,-2.44
BM05B-SRSS-TB = smd 0.6 x 1.55: 1 2,0; 2 1,0; 3 0,0; 4 -1,0; 5 -2,0 | smd 1.2 x 1.8: M1 3.3,-2.525; M2 -3.3,-2.525
JST-XH-05-PACKAGE-ROUND-PAD = drill 1.016: 1 -5.08,0; 2 -2.54,0; 3 0,0; 4 2.54,0; 5 5.08,0
JST-XH-04-PACKAGE-ROUND-PAD = drill 1.016: 1 -3.81,0; 2 -1.27,0; 3 1.27,0; 4 3.81,0
JST-XH-06-PACKAGE-ROUND-PAD = drill 1.016: 1 -6.35,0; 2 -3.81,0; 3 -1.27,0; 4 1.27,0; 5 3.81,0; 6 6.35,0
SG5032CCN20000000MHJGA3 = smd 1.6 x 2.032: 1 -1.27,-1.608; 2 1.27,-1.608; 3 1.27,1.608; 4 -1.27,1.608

### Placement (x,y rotation side)
C1  10.79,2.97 90 top
C3  43.07,14.63 180 top
C4  52.24,1.4 180 top
C5  44.86,33.27 0 top
C6  53.97,23.41 90 top
C7  37,14.22 180 top
C8  33.9,25.78 90 top
C9  48.94,11.18 0 top
C10  58.98,23.37 0 top
C12  10.67,8.51 90 top
D1  11.1,35.43 90 top
D2  10.75,17.78 90 top
IC1  45.51,2.29 180 top
IC2  45.51,6.35 0 top
IC3  14.65,7.11 270 top
J1  65.2,6.1 180 top
J2  59.99,42.04 180 top
J3  4.95,36.58 90 top
J4  3.98,21.84 270 top
J5  3.98,9.14 270 top
J6  37.93,3.94 90 top
J7  51.23,36.7 0 top
MCU1  44.39,23.95 0 top
PL1  40.81,3.56 90 top
Q1  15.29,37.21 180 top
R1  32.18,33.91 90 top
R2  47.42,14.61 180 top
R3  15.41,33.91 0 top
R4  40.81,8 90 top
U1  53.77,6.22 0 top
VR1  12.24,44.45 0 top
X1  56.94,13.97 0 top
X3  61.85,18.92 180 top
X4  23.88,34.54 0 top
X5  65.53,30.1 270 top
X6  16.64,22.35 90 top
Y1  55.16,28.32 180 top

### Tracks (layer width: path | path; a pad name or v marks a point on that pad's centre or on a via)
12VIN
  Top 0.813: 10.75,15.33 14.65,11.42 IC3.1 | 10.75,15.33 D2.1 10.75,15.9 12.54,17.69 12.54,22.77 9.27,26.04 5.08,26.04 3.1,28.02 3.1,33.32 3.81,34.04 J3.2 10.29,34.04 D1.1 | 10.75,15.33 9.48,14.06 9.48,11.73 10.67,10.54 C12.2
+5V  (via drill 0.35)
  Top 0.406: C5.1 43.59,32.95 MCU1.40 43.59,24.66 46.72,21.53 | C6.1 53.59,22.08 53.28,22.08 52.54,22.82 51.42,23.95 MCU1.28 49.14,23.95 46.72,21.53 | C7.+ 39.16,14.22 40.05,13.34 43.1,13.34 44.02,14.26 C3.1 44.4,15.01 44.4,18.26 MCU1.17 44.39,19.2 46.72,21.53 | C7.+ 38.02,14.1 39.62,12.49 v44.4,12.45 45.27,12.45 46.34,13.52 46.34,14.48 R2.2 46.47,14.4 48.08,12.79 55.52,12.79 55.94,13.21 | VR1.1 11.55,43.86 16.73,43.86 21.22,39.37 22.48,39.37 24.43,41.32 J2.15 24.43,40.64 27.15,37.92 33.03,37.92 34.08,36.87 v34.08,36.83 34.08,36.76 R1.2 32.05,34.73 27.79,34.73 X4.4 | Y1.4 56.44,25.09 58.02,23.5 C10.1 | Y1.4 Y1.1 | Y1.4 56.6,26.54 59.61,26.54 61.13,25.02 X5.5 65.53,25.15 67.31,26.92 67.31,35.73 66.33,36.7 J7.5 57.45,40.64 J2.2 | IC1.1 IC1.5 42.47,3.13 42.47,6.1 43.67,7.3 IC2.1 | IC2.1 IC2.5 | IC2.1 44.52,7.55 44.52,8.87 v44.45,8.94 44.44,8.95 R4.2 | 55.94,13.21 56.36,12.79 61.83,12.79 64.39,15.35 X3.2 | J6.2 36.37,8.03 36.37,11.18 37.77,12.57 37.77,13.97 C7.+ | 55.94,13.21 X1.4
  Bottom 0.406: v34.08,36.83 35.73,38.48 55.29,38.48 57.45,40.64 J2.2 | v44.4,12.45 44.42,12.43 44.4,8.99 v44.45,8.94 | X3.2 64.39,23.88 X5.5
A7
  Top 0.203: MCU1.13 41.19,19.3 41.2,19.3 40.88,19.62 39.99,19.62 38.35,17.98 24.74,17.98 19.1,23.62 X6.4
A10  (via drill 0.35)
  Top 0.203: MCU1.12 40.39,17.9 39.89,17.4 33.07,17.4 32.43,16.76 v32.18,16.76 | v30.27,14.46 29.13,15.6 17.04,15.6 X6.1
  Bottom 0.203: v32.18,16.76 32.18,16.62 30.27,14.71 v30.27,14.46
B9  (via drill 0.35)
  Top 0.203: MCU1.1 38.4,27.95 v38.4,30.61 | v30.65,25.27 30.53,25.15 24.34,25.15 18.27,31.22 5.23,31.22 J3.3
  Bottom 0.203: v30.65,25.27 30.65,27.94 34.08,31.37 37.64,31.37 v38.4,30.61
CLOCK
  Top 0.203: MCU1.30 50.09,25.52 50.67,25.52 51.86,26.71 Y1.3
GND  (via drill 0.35, 0.35 pad 0.82)
  Top 0.406: v40.18,14.99 40.53,14.63 C3.2 42.12,15.53 43.59,17 MCU1.16 43.61,18.3 v43.61,20.19 | v56.24,22.92 54.81,24.36 C6.2 53.82,24.2 53.28,24.75 MCU1.29 47.94,24.75 v47.93,24.77 | v58.8,25.45 58.93,25.45 59.92,24.45 C10.2 62.48,23.37 X3.1 | v40.75,23.18 39.98,23.95 MCU1.6 36.93,23.95 33.9,26.98 C8.2 33.9,29.79 v34.46,30.35 | v45.01,27.69 44.39,28.3 MCU1.39 44.37,29.64 44.37,30.73 45.81,32.17 C5.2 46.95,34.42 v47.55,34.42 | Y1.2 53.9,30.18 55.44,31.73 57.66,31.73 59.19,30.2 59.13,29.96 v59.13,28.83 60.93,27.13 65.1,27.13 X5.4 | C4.2 51.17,1.27 v49.45,1.27 | v48.05,4.32 49.06,4.32 49.32,4.06 U1.1 | v48.05,4.32 48.05,3.56 47.73,3.24 IC1.3 | v48.05,4.32 45.47,4.32 44.39,5.4 IC2.3 | J1.GND 60.37,7.7 v60.14,7.47 | X1.3 56.94,14.99 55.93,16 v55.29,16 | v42.59,1.27 42.05,1.27 PL1.C | X4.1 25.02,29.59 v30.53,29.59 | C9.2 51.05,11.18 51.68,10.55 v52.07,10.55 | C7.- 33.96,12.19 v32.38,12.19
  Top 0.813: VR1.3 15.28,42.01 16.34,40.95 Q1.2 | C1.1 6.11,2.02 J5.2 6.95,7.11 10.72,7.11 | 10.72,7.11 C12.1 | Q1.2 | v19.68,7.11 10.72,7.11
  Bottom 0.406: C7.- 37.51,15.75 39.42,15.75 v40.18,14.99 | v43.61,20.19 43.61,20.32 v40.75,23.18 | v45.01,27.69 v47.93,24.77 47.93,24.51 v43.61,20.19 | v47.55,34.42 48.95,34.42 50.94,32.44 56.89,32.44 59.13,30.19 v59.13,28.83 59.17,28.51 59.17,25.86 v58.8,25.45 58.42,25.07 57.12,25.07 56.18,24.13 56.18,22.99 v56.24,22.92 56.24,22.29 50.97,17.02 50.97,9.14 48.05,6.22 v48.05,4.32 | v49.45,1.27 49.45,1.91 48.05,3.3 v48.05,4.32 | v55.93,11.59 57.43,11.59 60.14,8.87 v60.14,7.47 52.1,7.47 48.94,4.32 v48.05,4.32 | v55.29,16 55.93,15.37 v55.93,11.59 | v42.59,1.27 v49.45,1.27 | v43.61,20.19 46.78,20.19 v46.91,20.32 | v49.45,1.27 57.58,1.27 v57.83,1.02 | VR1.3 14.78,42.26 15.29,42.77 19.25,42.77 v19.61,42.42 19.99,42.8 21.13,42.8 J2.16 21.89,40.89 23.67,39.12 25.95,39.12 30.53,34.54 v30.53,29.59 30.53,29.34 v25.07,23.88 | v48.05,4.32 49.45,5.71 v49.45,6.35 | J7.4 60.12,37.97 60.12,41.91 J2.1 62.02,42.04 67.31,36.75 67.31,29.33 X5.4 | v52.07,10.55 52.32,10.55 53.36,11.59 v55.93,11.59
  Bottom 0.813: C7.- 35.99,15.11 32.56,18.54 27.1,18.54 20.06,25.58 20.07,25.58 X4.1 20.07,37.85 15.9,42.01 VR1.3
  Bottom 1.016: 3.98,4.32 J5.2
  Bottom 2.032: J4.2 3.98,13.84 6.7,11.12 6.7,7.04 3.98,4.32
  other vias: 24.77,12.19 19.68,12.19 19.68,9.65 19.68,4.57 19.68,2.03 22.23,4.57 22.23,12.19 22.23,9.65 22.23,2.03 27.3,12.19 27.3,9.65 24.77,9.65 24.77,2.03 27.3,2.03 29.84,2.03 29.84,4.57 29.84,7.11 29.84,9.65 29.84,12.19 27.3,7.11 24.77,4.57 22.23,7.11 32.38,9.65 32.38,7.11 32.38,4.57 32.38,2.03 27.3,4.57 24.77,7.11 51.94,19.3 24.13,38.35 38.23,35.69 38.23,33.27 38.48,11.56
  pour Top (isolate 0.254, rank 2): 0,0 0,44.75 69.9,44.75 69.9,0
  pour Bottom (isolate 0.254): 0,0 0,44.75 69.9,44.75 69.9,0
  pour Top (no thermals): 21.34,13.08 30.73,13.08 30.73,1.27 21.34,1.27
GPIO0  (via drill 0.35)
  Top 0.203: MCU1.19 46.21,18.06 46.21,17.42 47.46,16.17 51.06,16.17 v52.14,15.09
  Bottom 0.203: v52.14,15.09 52.18,15.14 53.31,15.14 54.05,15.88 54.05,18.41 60.75,25.11 60.75,30.7 56.31,35.14 J7.3
GPIO1  (via drill 0.35)
  Top 0.203: MCU1.20 46.76,18.25 46.76,17.54 47.66,16.64 52.62,16.64 v53.01,16.26
  Bottom 0.203: J7.2 53.82,36.75 53.99,36.75 60.22,30.53 60.22,25.29 53.01,18.08 v53.01,16.26
GPIO2
  Top 0.203: MCU1.35 47.59,30.46 50.87,33.74 50.87,36.35 J7.1
GPIO3
  Top 0.203: X3.5 55.2,20.5 52.4,20.5 51.35,21.55 MCU1.25
GPIO4
  Top 0.203: X3.4 57.33,20.9 52.57,20.9 51.12,22.35 MCU1.26
GPIO5
  Top 0.203: MCU1.27 50.9,23.15 52.74,21.31 59.46,21.31 X3.3
IC1  (via drill 0.35)
  Top 0.203: v52.62,34.8 52.62,34.67 48.39,30.43 MCU1.34 | v34.21,34.29 32.88,32.96 R1.1 31.92,32.7 26.68,32.7 25.15,34.24 X4.3
  Bottom 0.203: v52.62,34.8 52.15,35.28 46.86,35.28 46.13,34.54 34.46,34.54 v34.21,34.29
IC2
  Top 0.203: MCU1.31 50.09,26.32 50.69,26.32 51.25,26.88 51.25,30.89 52.88,32.51 63.17,32.51 65.53,30.15 X5.3
IC3
  Top 0.203: MCU1.33 50.19,28.08 50.19,30.65 52.69,33.15 63.63,33.15 64.14,32.64 X5.2
IC4
  Top 0.203: MCU1.32 50.03,27.12 49.45,27.12 49.02,27.55 49.02,30.33 52.47,33.78 63.67,33.78 65.07,35.18 X5.1
LCD_DB0
  Top 0.203: MCU1.41 42.79,30.54 41.45,31.88 41.45,38.1 44.75,41.4 J2.7
LCD_DB1
  Top 0.203: MCU1.42 41.99,30.45 40.69,31.75 40.69,38.48 42.21,40.01 J2.8
LCD_DB2
  Top 0.203: MCU1.43 41.12,29.69 41.12,30.36 39.92,31.56 39.92,41.78 J2.9
LCD_DB3
  Top 0.203: MCU1.44 40.39,30.13 39.16,31.35 39.16,38.48 37.13,40.51 J2.10
LCD_DB4
  Top 0.203: MCU1.2 38.05,27.15 37.85,27.34 37.84,27.34 37.38,27.8 37.38,37.08 34.59,39.88 J2.11
LCD_DB5
  Top 0.203: MCU1.3 37.83,26.35 36.75,27.43 36.75,36.83 32.05,41.53 J2.12
LCD_DB6
  Top 0.203: J2.13 29.51,40.58 30.69,39.4 33.49,39.4 36.12,36.77 36.12,27.18 37.74,25.55 MCU1.4
LCD_DB7
  Top 0.203: MCU1.5 37.66,24.75 35.48,26.92 35.48,36.7 33.32,38.86 28.62,38.86 26.97,40.51 J2.14
LCD_E
  Top 0.203: MCU1.38 45.19,30.48 48.51,33.8 48.51,39.55 47.29,40.77 J2.6
LCD_RS
  Top 0.203: MCU1.36 46.79,30.48 49.58,33.27 49.58,38.48 52.37,41.27 J2.4
LCD_RW
  Top 0.203: J2.5 49.83,39.75 49.04,38.96 49.04,33.5 45.99,30.45 MCU1.37
MCLR
  Top 0.203: MCU1.18 45.19,17.4 46.84,15.75 47.23,15.75 R2.1 49.26,13.72 54.69,13.72 X1.5
N$1
  Top 0.203: U1.4 53.19,3.36 C4.1
N$3
  Top 0.813: J3.1 5.48,37.63 D1.2 13.81,37.63 Q1.3
N$4
  Top 0.203: U1.2 50.59,3.04 49.84,2.29 IC1.2
N$5  (via drill 0.35)
  Top 0.203: VR1.2 13.38,43.15 16.56,43.15 22.76,36.95 32.18,36.95 v32.3,36.83
  Bottom 0.203: J2.3 54.91,40.51 53.64,39.24 33.83,39.24 32.3,37.72 v32.3,36.83
N$6
  Top 0.406: R4.1 PL1.A
N$7
  Top 0.203: Q1.1 14.46,34.39 R3.1
N$8
  Top 0.813: J4.1 8.88,21.84 D2.2
  Top 1.778: J4.1 3.98,20.7 6.65,18.03 6.65,15.62 3.98,12.95 J5.1
N$9  (via drill 0.35)
  Top 0.61: IC3.3 14.65,3.13 v15.24,2.54
  Top 0.813: IC3.3 11.45,4.57 C1.2
  Bottom 0.61: v15.24,2.54 17.14,0.64 36.4,0.64 37.93,2.16 J6.1
N$14
  Top 0.203: U1.3 51.86,3.74 50.2,5.4 IC2.4
PGEC
  Top 0.203: MCU1.22 48.39,17.64 56.32,17.64 58.94,15.02 X1.1
PGED
  Top 0.203: X1.2 57.94,15 55.8,17.14 47.93,17.14 47.59,17.48 MCU1.21
PWM1H1
  Top 0.203: MCU1.14 41.99,17.43 41.32,16.76 34.07,16.76 33.08,15.77 31.46,15.77 30.34,16.89 22.27,16.89 18.08,21.08 X6.3
PWM1H2
  Top 0.203: MCU1.10 37.94,20.75 36.37,19.18 27.23,19.18 17.7,28.7 X6.6
PWM1H3
  Top 0.203: MCU1.8 37.66,22.35 35.72,20.41 32.83,20.41 31.76,21.47 31.76,25.75 31.17,26.34 24.79,26.34 17.22,33.91 R3.2
PWM1L1
  Top 0.203: MCU1.15 42.79,17.21 41.67,16.1 34.24,16.1 33.38,15.24 31.16,15.24 30.15,16.26 20.37,16.26 18.08,18.54 X6.2
PWM1L2
  Top 0.203: MCU1.11 38.28,19.95 36.88,18.54 27.1,18.54 19.48,26.16 X6.5
PWM1L3
  Top 0.203: MCU1.9 37.85,21.55 36.12,19.81 27.47,19.81 19.07,28.21 19.07,29.71 18.14,30.65 6.64,30.65 J3.4
U1RX  (via drill 0.35, 0.35 pad 0.82)
  Top 0.203: MCU1.23 50.21,19.8 v50.21,18.67 | IC1.4 44.26,3.54 v43.48,4.32
  Bottom 0.203: v43.48,4.32 50.21,11.05 v50.21,18.67
U1TX  (via drill 0.35, 0.35 pad 0.82)
  Top 0.203: MCU1.24 48.61,20.75 v48.43,20.57 | v46.27,9.78 46.27,9.37 47.8,7.85 47.8,6.87 47.23,6.31 44.3,6.31 IC2.2
  Bottom 0.203: v46.27,9.78 46.27,11.83 48.43,13.99 v48.43,20.57
USB_N
  Top 0.203: U1.6 55.67,4.12 55.46,4.34 55.46,4.77 56.19,5.49 60.78,5.49 60.98,5.3 J1.D-
USB_P
  Top 0.203: U1.5 54.4,4.29 56.02,5.9 60.47,5.9 60.66,6.1 J1.D+
VBUS  (via drill 0.35)
  Top 0.406: J6.3 39.9,10.99 47.81,10.99 C9.1 48.43,10.73 48.43,10.04 49.32,9.15 U1.16 49.32,8.21 51.44,6.1 v54.23,6.1 | v60.2,3.68 61.01,4.5 J1.VBUS
  Bottom 0.406: v54.23,6.1 57.78,6.1 v60.2,3.68
VCAP
  Top 0.203: 33.77,23.15 C8.1
  Top 0.406: MCU1.7 33.77,23.15

### Text on the board
bPlace: GPIO2 | GPIO1 | GPIO0 | GND | 5V | TempGuard / 2024 v1.0 / REVB | 12V | GND | 12V | EXT | USB | GND